# EAGLE design analog-noise-fob-sp23 (EAGLE 9.6.2)
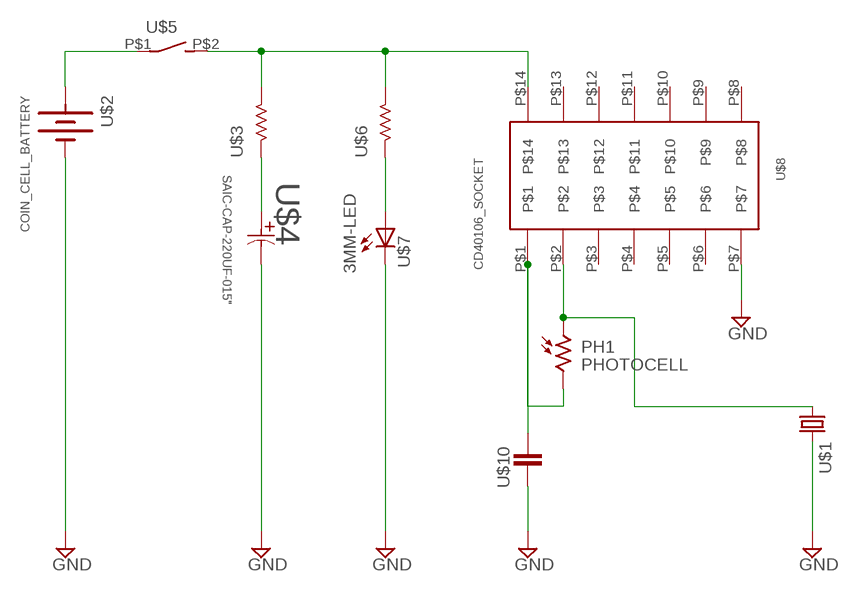
[diagram p0: schematic, sheet 1]

## Parts
PH1  PHOTOCELL  [PHOTOCELL]
U$1  PIEZO_BUZZER_2  [PIEZO_BUZZER_2]
U$2  COIN_CELL_BATTERY  [COIN_BATTERY]
U$3  RESISTOR-1/4W-THROUGH-HOLE  [1/4W_TH_RESISTOR]
U$4  SAIC-CAP-220UF-015"  [SAIC-CAP-0.15"-LEAD-SPACING-01]
U$5  TACTILE_SWITCH  [TACTILE_SWITCH]
U$6  RESISTOR-1/4W-THROUGH-HOLE  [1/4W_TH_RESISTOR]
U$7  3MM-LED  [LED3MM]
U$8  CD40106_SOCKET  [DIP_14_SOCKET]
U$10  SAIC-CAP-0.1UF-02"  [SAIC-CAP-0.2"-LEAD-SPACING-03]

## Nets
GND: U$1.P$2 U$2.P$2(-) U$4.P$2 U$7.K U$8.P$7 U$10.P$1
N$1: U$2.P$1(+) U$5.P$1(P)
N$2: U$3.P$2 U$5.P$2(S) U$6.P$2 U$8.P$14
N$3: U$3.P$1 U$4.P$1
N$4: U$6.P$1 U$7.A
N$5: PH1.P$1 U$1.P$1 U$8.P$2
N$6: PH1.P$2 U$8.P$1 U$10.P$2
Unconnected: U$8.P$3 U$8.P$4 U$8.P$5 U$8.P$6 U$8.P$8 U$8.P$9 U$8.P$10 U$8.P$11 U$8.P$12 U$8.P$13

## Library data of the parts
PH1 = MODEL2OBJECT:PHOTOCELL: Photo Sensor
U$1 = MODEL2OBJECT:PIEZO_BUZZER_2
U$2 = MODEL2OBJECT:COIN_CELL_BATTERY
U$3 U$6 = MODEL2OBJECT:RESISTOR-1/4W-THROUGH-HOLE
U$4 = MODEL2OBJECT:SAIC-CAP-220UF-015"
U$5 = MODEL2OBJECT:TACTILE_SWITCH
U$7 = MODEL2OBJECT:3MM-LED
U$8 = MODEL2OBJECT:CD40106_SOCKET
U$10 = MODEL2OBJECT:SAIC-CAP-0.1UF-02"

## Board
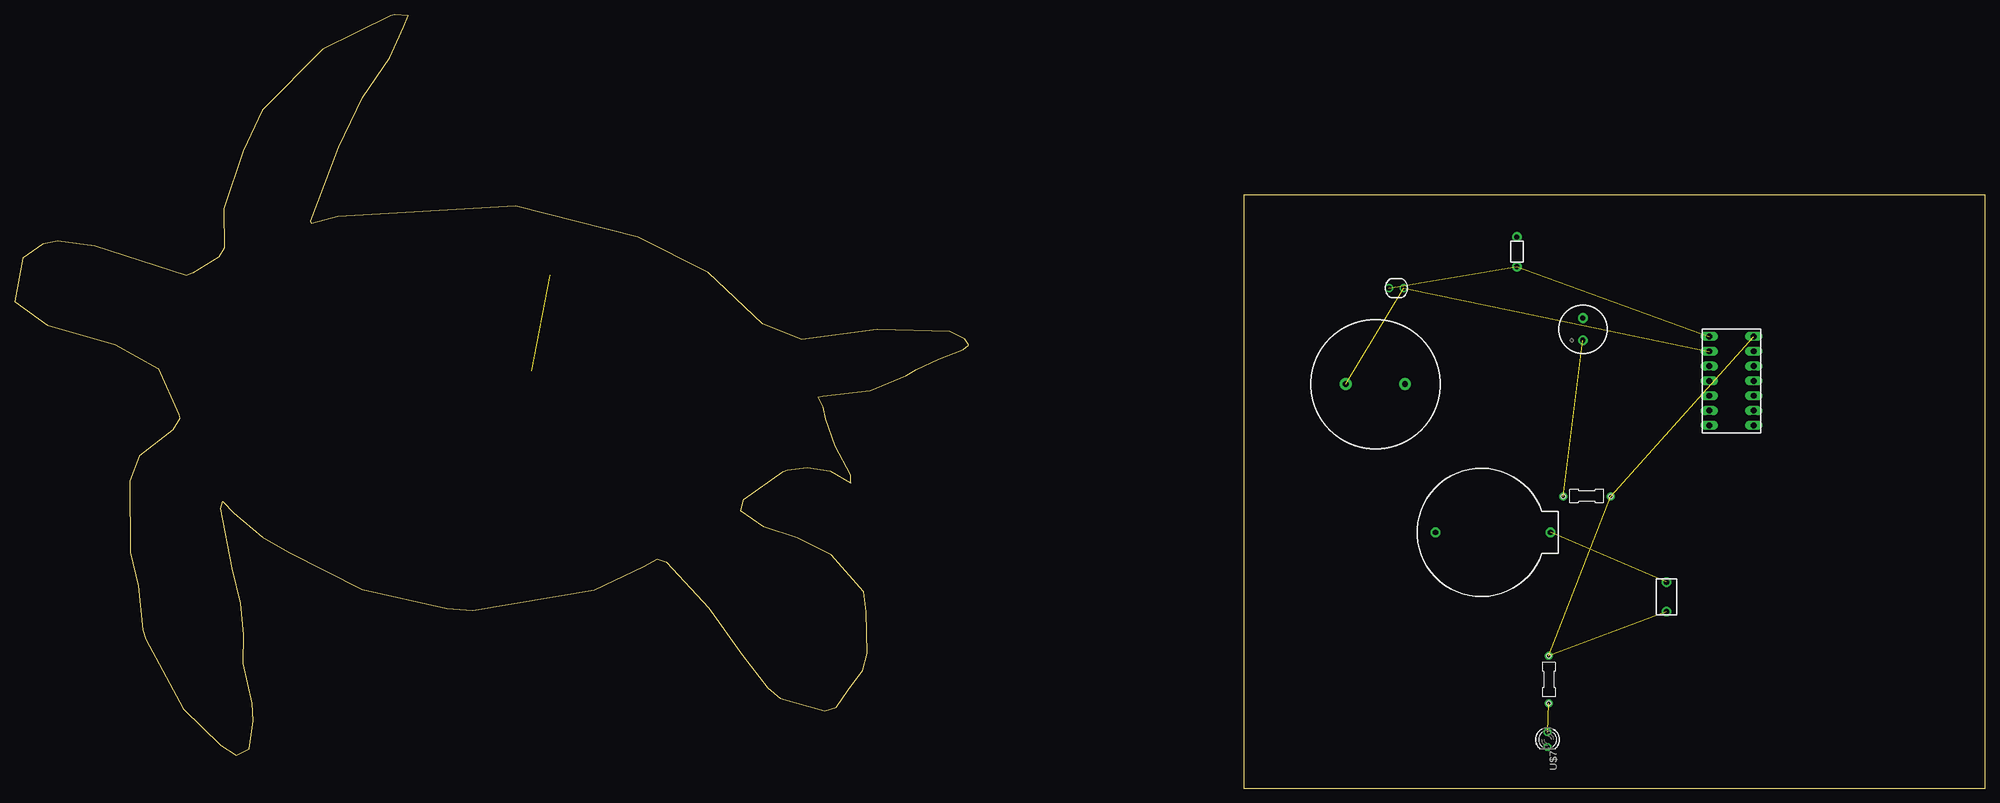
[diagram p1: board, top side]
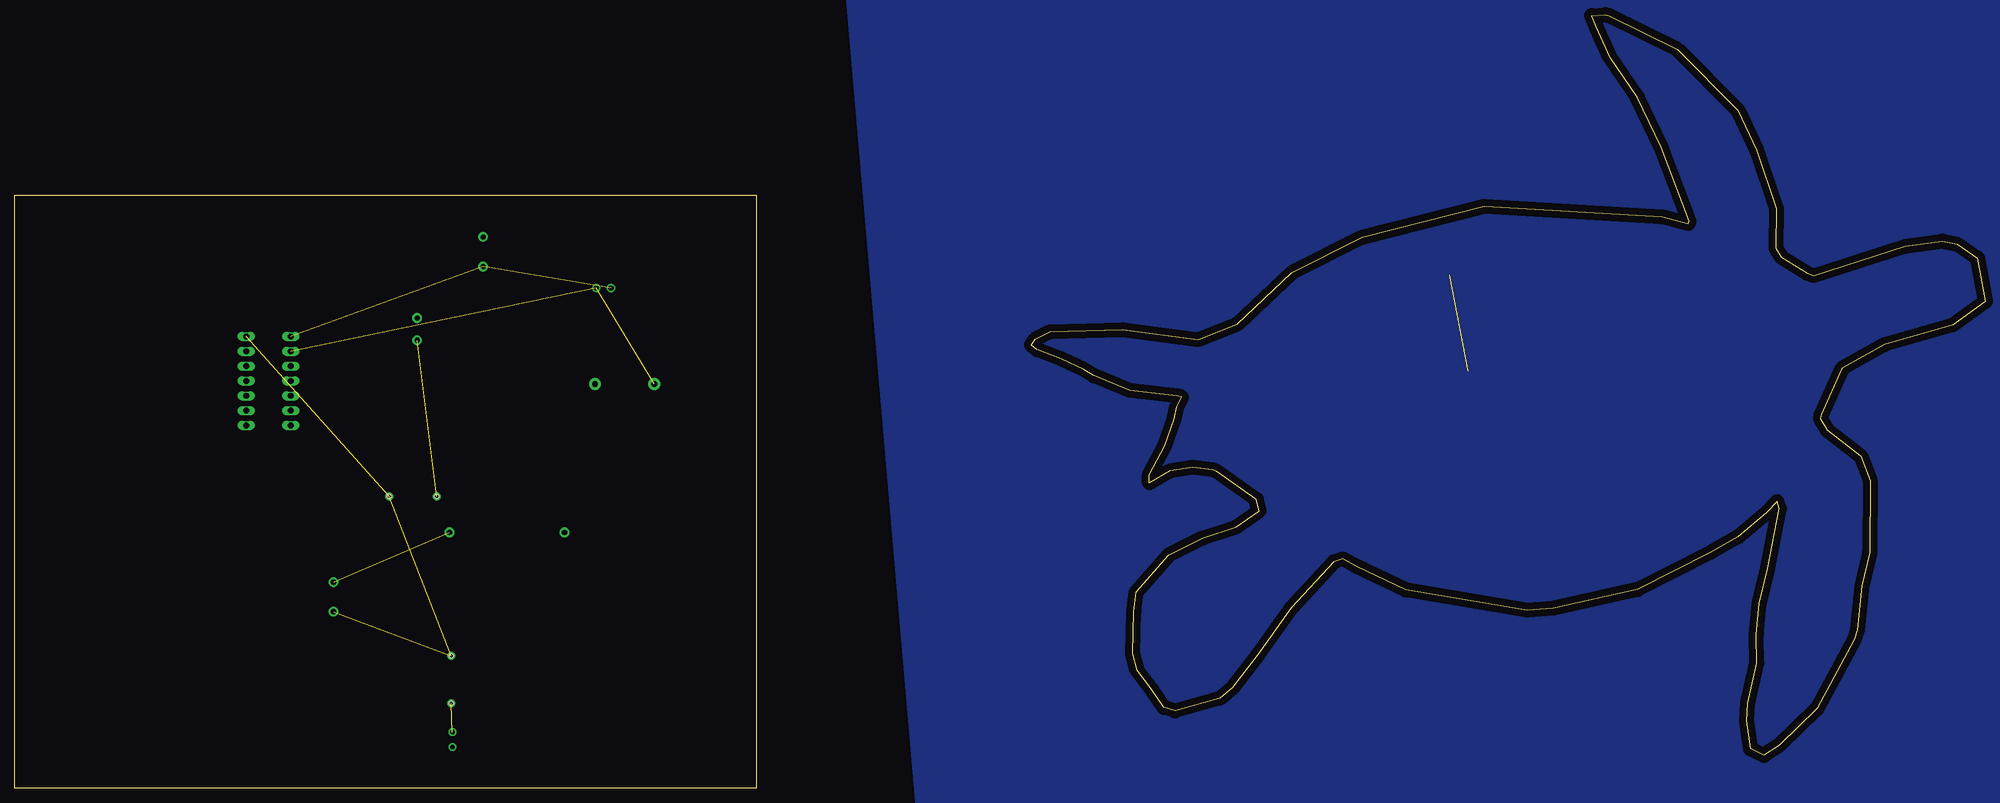
[diagram p2: board, bottom side, seen from below]

Size 337.53 x 132.58 mm. Coordinates in mm from the lower left corner, seen from the top.
Outline: 137.64,67.01 138.37,67.2 146.55,68.17 152.74,70.69 154.38,71.73 158.31,73.57 162.45,75.15 163.38,75.96 162.7,76.94 160.12,78.24 147.71,78.6 134.8,76.91 128.12,79.57 118.79,88.39 106.69,94.42 85.86,99.75 55.38,97.94 50.88,96.77 50.73,97.17 55.54,109.87 59.61,118.44 64.23,125.16 66.69,130.47 67.44,132.42 65.08,132.58 64.44,132.42 52.8,126.63 42.41,116.19 39.2,109.27 35.81,99.35 35.89,92.54 34.95,91 30.51,88.28 29.44,87.86 13.71,92.88 7.36,93.78 4.86,93.21 1.37,90.88 0,83.43 5.59,79.42 17.25,76.02 24.56,71.9 28.15,64.03 28.26,63.38 27.11,61.37 21.36,56.93 19.76,52.63 19.82,40.45 21.15,34.7 21.93,27.11 22.48,25.5 28.85,13.57 35.32,7.39 37.93,5.63 40.2,6.74 40.9,11.54 40.7,14.54 39.15,21.43 39.24,26.32 38.75,31.7 37.29,37.68 35.28,47.92 35.65,49.13 37.52,47.16 42.45,43.03 47.01,40.44 59.56,34.08 73.98,30.83 78.44,30.49 99.31,33.96 107.76,38.05 110.03,39.3 111.56,38.81 118.91,30.9 124.61,22.82 129.02,17.19 131.11,15.44 138.78,13.27 140.7,13.87 142.75,16.86 145.22,20.17 146.03,23.13 145.85,30.24 145.43,33.65 139.9,39.96 134.04,42.89 128.3,44.81 124.4,47.55 124.87,49.49 131.64,54.27 132.34,54.56 135.73,54.99 139.67,54.37 143.17,52.34 143.18,53.69 140.55,58.61 138.94,63.32 138.51,65.32 137.64,67.01
Outline: 210.53,0 337.53,0 337.53,101.6 210.53,101.6 210.53,0
Copper layers (1*16): Top 0.035mm / dielectric 1.5mm / Bottom 0.035mm
Design rules "default": minimum track width 6mil, minimum drill 0.35mm, track to track 6mil, track to pad 6mil, pad to pad 6mil, via to via 6mil, smd to smd 6mil, copper to edge 40mil, drill to drill 6mil, minimum pad ring 10mil, minimum via ring 8mil, stop-mask expansion 4mil, vias tented up to drill 0mil, thermal gap 10mil

### Footprints (pad centres in the part's own frame; a part is rotated, then mirrored left to right if it is on the bottom)
PHOTOCELL = drill 0.889: P$1 0,0; P$2 0,-2.54
PIEZO_BUZZER_2 = drill 1.016 pad 2.032: P$1 0,0; P$2 0,10.16
COIN_BATTERY = drill 0.914 pad 1.651: P$1 0,0; P$2 0,-19.685
1/4W_TH_RESISTOR = drill 0.889: P$1 -4.064,0; P$2 4.064,0 | hole 0.762: -4.064,0; 4.064,0
SAIC-CAP-0.15"-LEAD-SPACING-01 = drill 0.889 pad 1.651: P$1 -1.905,0; P$2 1.905,0
TACTILE_SWITCH = drill 0.914 pad 1.651: P$1 0,0; P$2 0,-5.08
LED3MM = drill 0.813 octagon: A -1.27,0; K 1.27,0
DIP_14_SOCKET = drill 1.016 long: P$1 0,0; P$2 0,2.54; P$3 0,5.08; P$4 0,7.62; P$5 0,10.16; P$6 0,12.7; P$7 0,15.24; P$8 -7.62,15.24; P$9 -7.62,12.7; P$10 -7.62,10.16; P$11 -7.62,7.62; P$12 -7.62,5.08; P$13 -7.62,2.54; P$14 -7.62,0
SAIC-CAP-0.2"-LEAD-SPACING-03 = drill 0.889 pad 1.651: P$1 -2.54,0; P$2 2.54,0

### Placement (x,y rotation side)
PH1  237.92,85.69 270 top
U$1  227.97,69.27 270 top
U$2  263.06,43.84 270 top
U$3  269.28,50.03 0 top
U$4  268.59,78.67 90 top
U$5  282.88,35.34 0 top
U$6  262.75,18.61 90 top
U$7  262.54,8.35 270 top
U$8  290.23,77.42 180 top
U$10  257.28,91.93 270 top

### Tracks (layer width: path | path; a pad name or v marks a point on that pad's centre or on a via)
GND  (1 unrouted)
  pour Bottom (isolate 1.27): -5.37,-7.62 -5.37,144.78 195.29,137.16 182.59,-10.16
N$1  (1 unrouted)
N$2  (3 unrouted)
N$3  (1 unrouted)
N$4  (1 unrouted)
N$5  (2 unrouted)
N$6  (2 unrouted)